# Altium schematic sheet interfaces_fpga.SchDoc
size A3
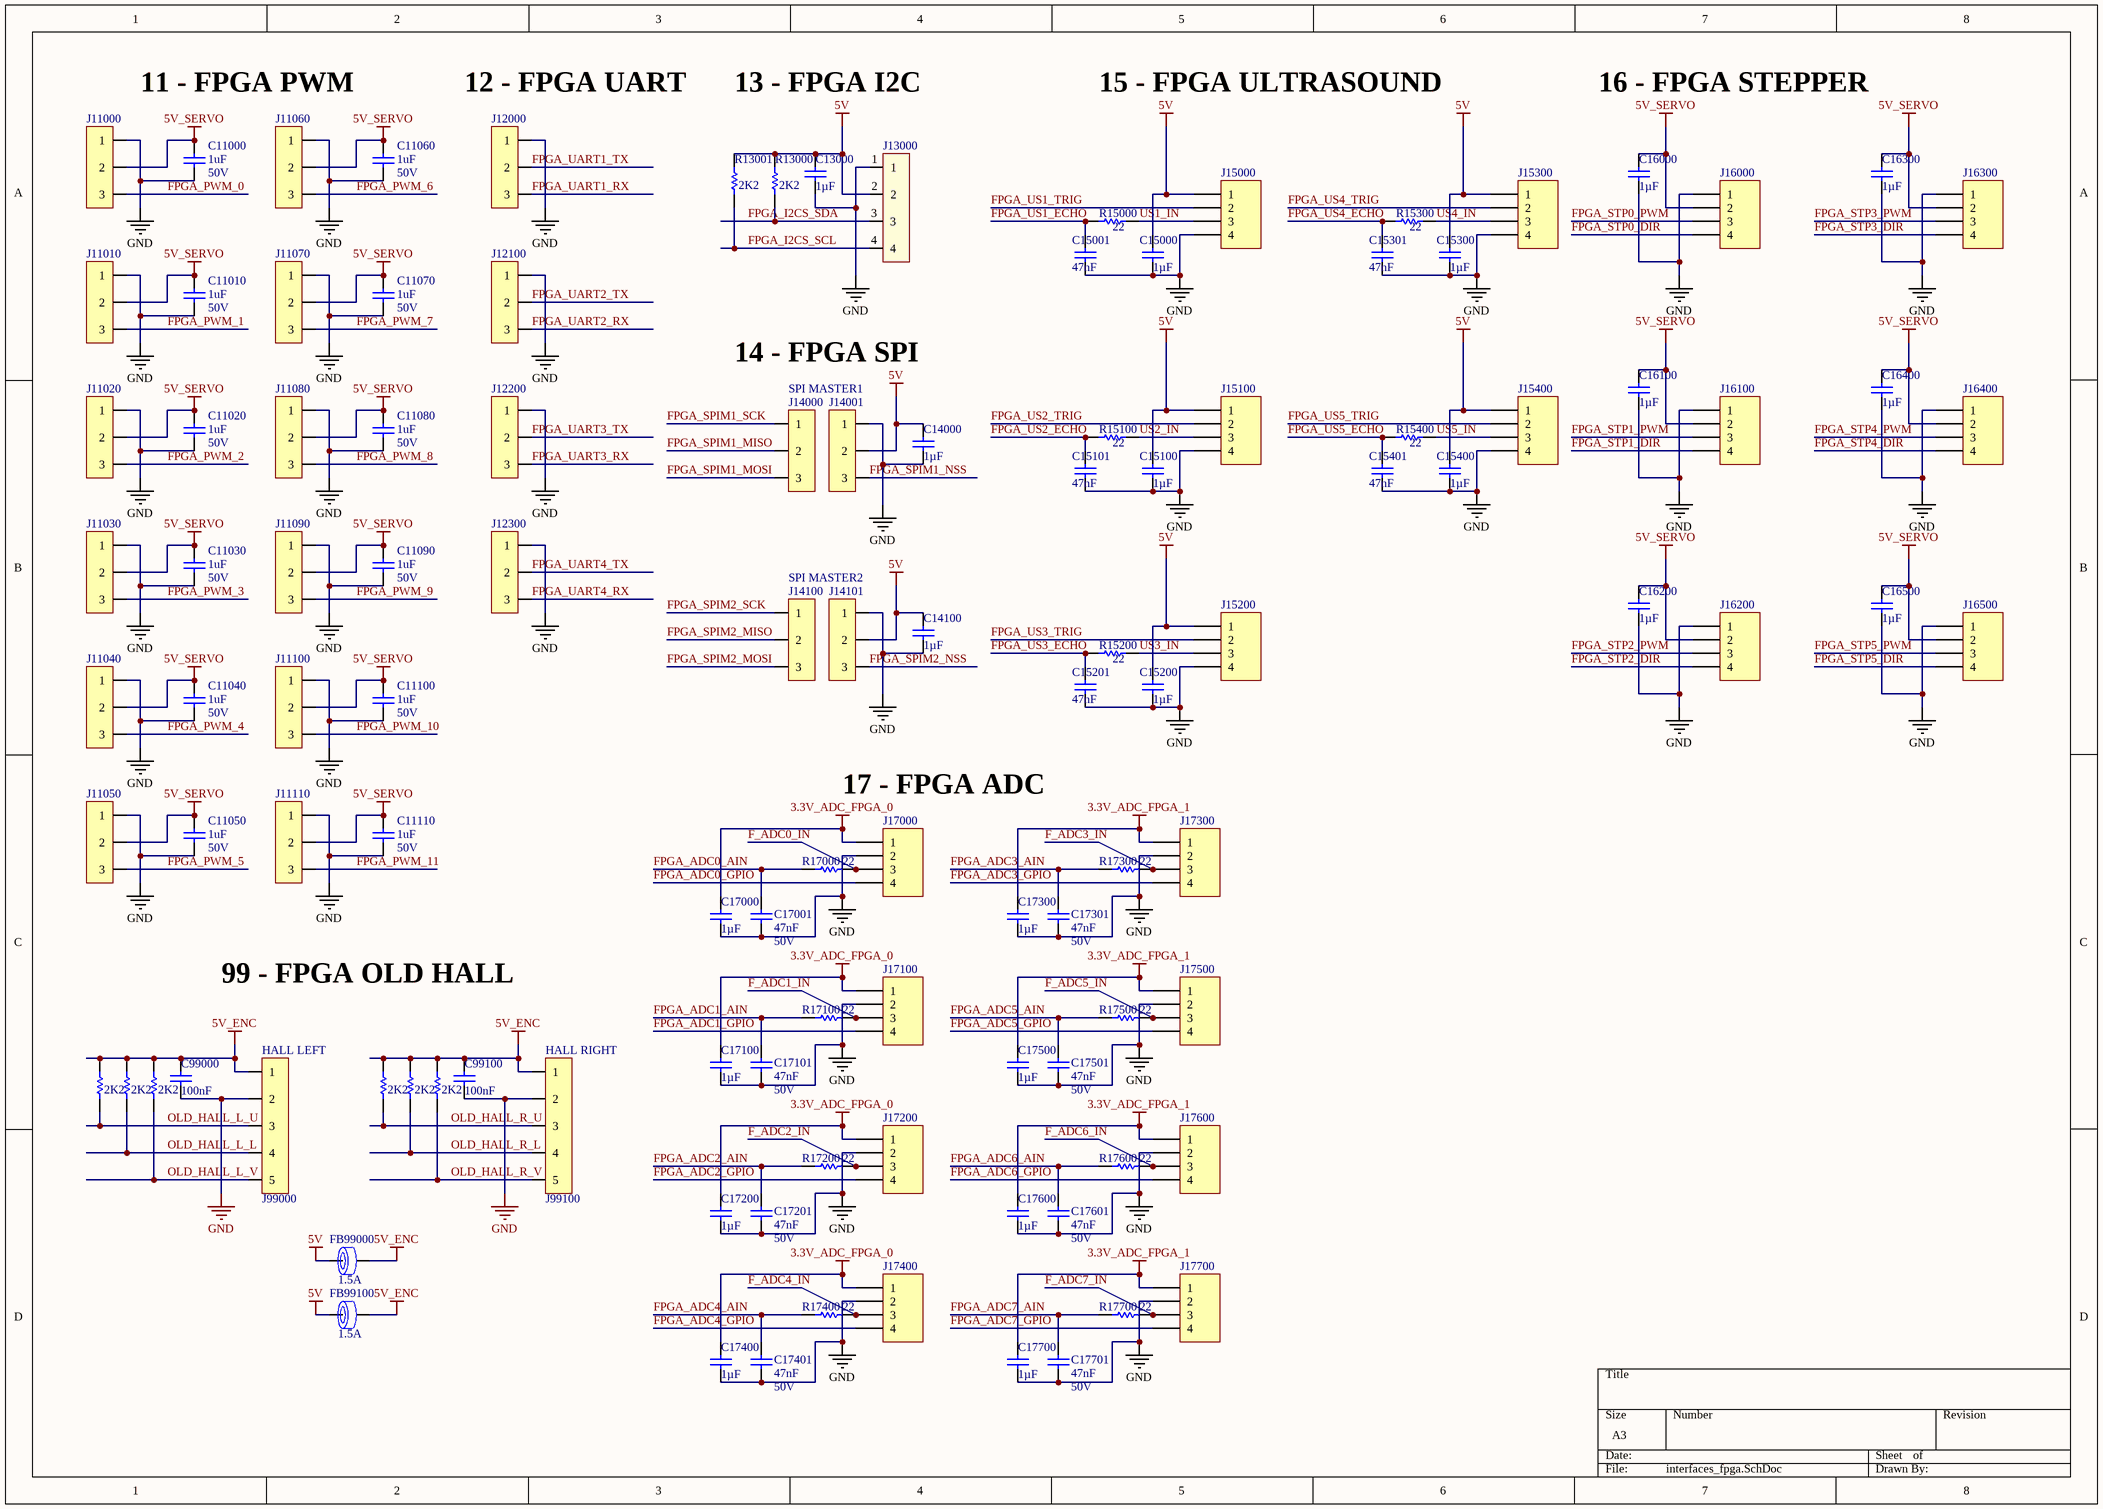
[diagram p0: interfaces_fpga.SchDoc]

## Parts
C11000  1uF  RatedVoltage: 50V  [WCAP-CSGP_0805, 2x1.25x1.25]
C11010  1uF  RatedVoltage: 50V  [WCAP-CSGP_0805, 2x1.25x1.25]
C11020  1uF  RatedVoltage: 50V  [WCAP-CSGP_0805, 2x1.25x1.25]
C11030  1uF  RatedVoltage: 50V  [WCAP-CSGP_0805, 2x1.25x1.25]
C11040  1uF  RatedVoltage: 50V  [WCAP-CSGP_0805, 2x1.25x1.25]
C11050  1uF  RatedVoltage: 50V  [WCAP-CSGP_0805, 2x1.25x1.25]
C11060  1uF  RatedVoltage: 50V  [WCAP-CSGP_0805, 2x1.25x1.25]
C11070  1uF  RatedVoltage: 50V  [WCAP-CSGP_0805, 2x1.25x1.25]
C11080  1uF  RatedVoltage: 50V  [WCAP-CSGP_0805, 2x1.25x1.25]
C11090  1uF  RatedVoltage: 50V  [WCAP-CSGP_0805, 2x1.25x1.25]
C11100  1uF  RatedVoltage: 50V  [WCAP-CSGP_0805, 2x1.25x1.25]
C11110  1uF  RatedVoltage: 50V  [WCAP-CSGP_0805, 2x1.25x1.25]
C13000  1µF  [WCAP-CSGP_0603, 1.6x0.8x0.8]
C14000  1µF  [WCAP-CSGP_0603, 1.6x0.8x0.8]
C14100  1µF  [WCAP-CSGP_0603, 1.6x0.8x0.8]
C15000  1µF  [WCAP-CSGP_0603, 1.6x0.8x0.8]
C15001  47nF  [WCAP-CSGP_0603, 1.6x0.8x0.8]
C15100  1µF  [WCAP-CSGP_0603, 1.6x0.8x0.8]
C15101  47nF  [WCAP-CSGP_0603, 1.6x0.8x0.8]
C15200  1µF  [WCAP-CSGP_0603, 1.6x0.8x0.8]
C15201  47nF  [WCAP-CSGP_0603, 1.6x0.8x0.8]
C15300  1µF  [WCAP-CSGP_0603, 1.6x0.8x0.8]
C15301  47nF  [WCAP-CSGP_0603, 1.6x0.8x0.8]
C15400  1µF  [WCAP-CSGP_0603, 1.6x0.8x0.8]
C15401  47nF  [WCAP-CSGP_0603, 1.6x0.8x0.8]
C16000  1µF  [WCAP-CSGP_0603, 1.6x0.8x0.8]
C16100  1µF  [WCAP-CSGP_0603, 1.6x0.8x0.8]
C16200  1µF  [WCAP-CSGP_0603, 1.6x0.8x0.8]
C16300  1µF  [WCAP-CSGP_0603, 1.6x0.8x0.8]
C16400  1µF  [WCAP-CSGP_0603, 1.6x0.8x0.8]
C16500  1µF  [WCAP-CSGP_0603, 1.6x0.8x0.8]
C17000  1µF  [WCAP-CSGP_0603, 1.6x0.8x0.8]
C17001  47nF  RatedVoltage: 50V  [WCAP-CSGP_0603, 1.6x0.8x0.8]
C17100  1µF  [WCAP-CSGP_0603, 1.6x0.8x0.8]
C17101  47nF  RatedVoltage: 50V  [WCAP-CSGP_0603, 1.6x0.8x0.8]
C17200  1µF  [WCAP-CSGP_0603, 1.6x0.8x0.8]
C17201  47nF  RatedVoltage: 50V  [WCAP-CSGP_0603, 1.6x0.8x0.8]
C17300  1µF  [WCAP-CSGP_0603, 1.6x0.8x0.8]
C17301  47nF  RatedVoltage: 50V  [WCAP-CSGP_0603, 1.6x0.8x0.8]
C17400  1µF  [WCAP-CSGP_0603, 1.6x0.8x0.8]
C17401  47nF  RatedVoltage: 50V  [WCAP-CSGP_0603, 1.6x0.8x0.8]
C17500  1µF  [WCAP-CSGP_0603, 1.6x0.8x0.8]
C17501  47nF  RatedVoltage: 50V  [WCAP-CSGP_0603, 1.6x0.8x0.8]
C17600  1µF  [WCAP-CSGP_0603, 1.6x0.8x0.8]
C17601  47nF  RatedVoltage: 50V  [WCAP-CSGP_0603, 1.6x0.8x0.8]
C17700  1µF  [WCAP-CSGP_0603, 1.6x0.8x0.8]
C17701  47nF  RatedVoltage: 50V  [WCAP-CSGP_0603, 1.6x0.8x0.8]
C99000  100nF  [WCAP-CSGP_0603, 1.6x0.8x0.8]
C99100  100nF  [WCAP-CSGP_0603, 1.6x0.8x0.8]
FB99000  RatedCurrent: 1.5A  [WE-CBF_0603_High Current]  (hidden comment: 742792624)
FB99100  RatedCurrent: 1.5A  [WE-CBF_0603_High Current]  (hidden comment: 742792624)
J11000  22-03-2031  [22-03-2031]  (value not drawn)
J11010  22-03-2031  [22-03-2031]  (value not drawn)
J11020  22-03-2031  [22-03-2031]  (value not drawn)
J11030  22-03-2031  [22-03-2031]  (value not drawn)
J11040  22-03-2031  [22-03-2031]  (value not drawn)
J11050  22-03-2031  [22-03-2031]  (value not drawn)
J11060  22-03-2031  [22-03-2031]  (value not drawn)
J11070  22-03-2031  [22-03-2031]  (value not drawn)
J11080  22-03-2031  [22-03-2031]  (value not drawn)
J11090  22-03-2031  [22-03-2031]  (value not drawn)
J11100  22-03-2031  [22-03-2031]  (value not drawn)
J11110  22-03-2031  [22-03-2031]  (value not drawn)
J12000  22-03-2031  [22-03-2031]  (value not drawn)
J12100  22-03-2031  [22-03-2031]  (value not drawn)
J12200  22-03-2031  [22-03-2031]  (value not drawn)
J12300  22-03-2031  [22-03-2031]  (value not drawn)
J13000  22-27-2041  [22-27-2041]  (value not drawn)
J14000  22-03-2031  [22-03-2031]  (value not drawn)
J14001  22-03-2031  [22-03-2031]  (value not drawn)
J14100  22-03-2031  [22-03-2031]  (value not drawn)
J14101  22-03-2031  [22-03-2031]  (value not drawn)
J15000  MC34645  [HDR1X4]  (value not drawn)
J15100  MC34645  [HDR1X4]  (value not drawn)
J15200  MC34645  [HDR1X4]  (value not drawn)
J15300  MC34645  [HDR1X4]  (value not drawn)
J15400  MC34645  [HDR1X4]  (value not drawn)
J16000  MC34645  [HDR1X4]  (value not drawn)
J16100  MC34645  [HDR1X4]  (value not drawn)
J16200  MC34645  [HDR1X4]  (value not drawn)
J16300  MC34645  [HDR1X4]  (value not drawn)
J16400  MC34645  [HDR1X4]  (value not drawn)
J16500  MC34645  [HDR1X4]  (value not drawn)
J17000  MC34645  [HDR1X4]  (value not drawn)
J17100  MC34645  [HDR1X4]  (value not drawn)
J17200  MC34645  [HDR1X4]  (value not drawn)
J17300  MC34645  [HDR1X4]  (value not drawn)
J17400  MC34645  [HDR1X4]  (value not drawn)
J17500  MC34645  [HDR1X4]  (value not drawn)
J17600  MC34645  [HDR1X4]  (value not drawn)
J17700  MC34645  [HDR1X4]  (value not drawn)
J99000  22-03-2051  [22-03-2051]  (value not drawn)
J99100  22-03-2051  [22-03-2051]  (value not drawn)
R13000  value 2K2  [RESC1005X04N]  (hidden comment: RC0402FR-07100RL)
R13001  value 2K2  [RESC1005X04N]  (hidden comment: RC0402FR-07100RL)
R15000  value 22  [RESC1005X04N]  (hidden comment: RC0402FR-0722RL)
R15100  value 22  [RESC1005X04N]  (hidden comment: RC0402FR-0722RL)
R15200  value 22  [RESC1005X04N]  (hidden comment: RC0402FR-0722RL)
R15300  value 22  [RESC1005X04N]  (hidden comment: RC0402FR-0722RL)
R15400  value 22  [RESC1005X04N]  (hidden comment: RC0402FR-0722RL)
R17000  value 22  [RESC1005X04N]  (hidden comment: RC0402FR-0722RL)
R17100  value 22  [RESC1005X04N]  (hidden comment: RC0402FR-0722RL)
R17200  value 22  [RESC1005X04N]  (hidden comment: RC0402FR-0722RL)
R17300  value 22  [RESC1005X04N]  (hidden comment: RC0402FR-0722RL)
R17400  value 22  [RESC1005X04N]  (hidden comment: RC0402FR-0722RL)
R17500  value 22  [RESC1005X04N]  (hidden comment: RC0402FR-0722RL)
R17600  value 22  [RESC1005X04N]  (hidden comment: RC0402FR-0722RL)
R17700  value 22  [RESC1005X04N]  (hidden comment: RC0402FR-0722RL)
R99000  value 2K2  [RESC1005X04N]  (hidden comment: RC0402FR-07100RL)
R99001  value 2K2  [RESC1005X04N]  (hidden comment: RC0402FR-07100RL)
R99002  value 2K2  [RESC1005X04N]  (hidden comment: RC0402FR-07100RL)
R99100  value 2K2  [RESC1005X04N]  (hidden comment: RC0402FR-07100RL)
R99101  value 2K2  [RESC1005X04N]  (hidden comment: RC0402FR-07100RL)
R99102  value 2K2  [RESC1005X04N]  (hidden comment: RC0402FR-07100RL)

## Nets
3.3V_ADC_FPGA_0: C17000.1 C17100.1 C17200.1 C17400.1 J17000.1 J17100.1 J17200.1 J17400.1
3.3V_ADC_FPGA_1: C17300.1 C17500.1 C17600.1 C17700.1 J17300.1 J17500.1 J17600.1 J17700.1
5V: C13000.1 C14000.1 C14100.1 C15000.1 C15100.1 C15200.1 C15300.1 C15400.1 FB99000.1 FB99100.1 J13000.2 J14001.2 J14101.2 J15000.1 J15100.1 J15200.1 J15300.1 J15400.1 R13000.2 R13001.2
5V_ENC: C99000.1 C99100.1 FB99000.2 FB99100.2 J99000.1 J99100.1 R99000.2 R99001.2 R99002.2 R99100.2 R99101.2 R99102.2
5V_SERVO: C11000.2 C11010.2 C11020.2 C11030.2 C11040.2 C11050.2 C11060.2 C11070.2 C11080.2 C11090.2 C11100.2 C11110.2 C16000.1 C16100.1 C16200.1 C16300.1 C16400.1 C16500.1 J11000.2 J11010.2 J11020.2 J11030.2 J11040.2 J11050.2 J11060.2 J11070.2 J11080.2 J11090.2 J11100.2 J11110.2 J16000.2 J16100.2 J16200.2 J16300.2 J16400.2 J16500.2
GND: C11000.1 C11010.1 C11020.1 C11030.1 C11040.1 C11050.1 C11060.1 C11070.1 C11080.1 C11090.1 C11100.1 C11110.1 C13000.2 C14000.2 C14100.2 C15000.2 C15001.1 C15100.2 C15101.1 C15200.2 C15201.1 C15300.2 C15301.1 C15400.2 C15401.1 C16000.2 C16100.2 C16200.2 C16300.2 C16400.2 C16500.2 C17000.2 C17001.1 C17100.2 C17101.1 C17200.2 C17201.1 C17300.2 C17301.1 C17400.2 C17401.1 C17500.2 C17501.1 C17600.2 C17601.1 C17700.2 C17701.1 C99000.2 C99100.2 J11000.1 J11010.1 J11020.1 J11030.1 J11040.1 J11050.1 J11060.1 J11070.1 J11080.1 J11090.1 J11100.1 J11110.1 J12000.1 J12100.1 J12200.1 J12300.1 J13000.1 J14001.1 J14101.1 J15000.4 J15100.4 J15200.4 J15300.4 J15400.4 J16000.1 J16100.1 J16200.1 J16300.1 J16400.1 J16500.1 J17000.2 J17100.2 J17200.2 J17300.2 J17400.2 J17500.2 J17600.2 J17700.2 J99000.2 J99100.2
F_ADC0_IN: J17000.3 R17000.2
F_ADC1_IN: J17100.3 R17100.2
F_ADC2_IN: J17200.3 R17200.2
F_ADC3_IN: J17300.3 R17300.2
F_ADC4_IN: J17400.3 R17400.2
F_ADC5_IN: J17500.3 R17500.2
F_ADC6_IN: J17600.3 R17600.2
F_ADC7_IN: J17700.3 R17700.2
FPGA_ADC0_AIN: C17001.2 R17000.1
FPGA_ADC0_GPIO: J17000.4
FPGA_ADC1_AIN: C17101.2 R17100.1
FPGA_ADC1_GPIO: J17100.4
FPGA_ADC2_AIN: C17201.2 R17200.1
FPGA_ADC2_GPIO: J17200.4
FPGA_ADC3_AIN: C17301.2 R17300.1
FPGA_ADC3_GPIO: J17300.4
FPGA_ADC4_AIN: C17401.2 R17400.1
FPGA_ADC4_GPIO: J17400.4
FPGA_ADC5_AIN: C17501.2 R17500.1
FPGA_ADC5_GPIO: J17500.4
FPGA_ADC6_AIN: C17601.2 R17600.1
FPGA_ADC6_GPIO: J17600.4
FPGA_ADC7_AIN: C17701.2 R17700.1
FPGA_ADC7_GPIO: J17700.4
FPGA_I2CS_SCL: J13000.4 R13001.1
FPGA_I2CS_SDA: J13000.3 R13000.1
FPGA_PWM_0: J11000.3
FPGA_PWM_1: J11010.3
FPGA_PWM_2: J11020.3
FPGA_PWM_3: J11030.3
FPGA_PWM_4: J11040.3
FPGA_PWM_5: J11050.3
FPGA_PWM_6: J11060.3
FPGA_PWM_7: J11070.3
FPGA_PWM_8: J11080.3
FPGA_PWM_9: J11090.3
FPGA_PWM_10: J11100.3
FPGA_PWM_11: J11110.3
FPGA_SPIM1_MISO: J14000.2
FPGA_SPIM1_MOSI: J14000.3
FPGA_SPIM1_NSS: J14001.3
FPGA_SPIM1_SCK: J14000.1
FPGA_SPIM2_MISO: J14100.2
FPGA_SPIM2_MOSI: J14100.3
FPGA_SPIM2_NSS: J14101.3
FPGA_SPIM2_SCK: J14100.1
FPGA_STP0_DIR: J16000.4
FPGA_STP0_PWM: J16000.3
FPGA_STP1_DIR: J16100.4
FPGA_STP1_PWM: J16100.3
FPGA_STP2_DIR: J16200.4
FPGA_STP2_PWM: J16200.3
FPGA_STP3_DIR: J16300.4
FPGA_STP3_PWM: J16300.3
FPGA_STP4_DIR: J16400.4
FPGA_STP4_PWM: J16400.3
FPGA_STP5_DIR: J16500.4
FPGA_STP5_PWM: J16500.3
FPGA_UART1_RX: J12000.3
FPGA_UART1_TX: J12000.2
FPGA_UART2_RX: J12100.3
FPGA_UART2_TX: J12100.2
FPGA_UART3_RX: J12200.3
FPGA_UART3_TX: J12200.2
FPGA_UART4_RX: J12300.3
FPGA_UART4_TX: J12300.2
FPGA_US1_ECHO: C15001.2 R15000.1
FPGA_US1_TRIG: J15000.2
FPGA_US2_ECHO: C15101.2 R15100.1
FPGA_US2_TRIG: J15100.2
FPGA_US3_ECHO: C15201.2 R15200.1
FPGA_US3_TRIG: J15200.2
FPGA_US4_ECHO: C15301.2 R15300.1
FPGA_US4_TRIG: J15300.2
FPGA_US5_ECHO: C15401.2 R15400.1
FPGA_US5_TRIG: J15400.2
OLD_HALL_L_L: J99000.4 R99001.1
OLD_HALL_L_U: J99000.3 R99000.1
OLD_HALL_L_V: J99000.5 R99002.1
OLD_HALL_R_L: J99100.4 R99101.1
OLD_HALL_R_U: J99100.3 R99100.1
OLD_HALL_R_V: J99100.5 R99102.1
US1_IN: J15000.3 R15000.2
US2_IN: J15100.3 R15100.2
US3_IN: J15200.3 R15200.2
US4_IN: J15300.3 R15300.2
US5_IN: J15400.3 R15400.2

## Notes on the sheet
- 11 - FPGA PWM
- (near J12000) 12 - FPGA UART
- 13 - FPGA I2C
- 15 - FPGA ULTRASOUND
- 16 - FPGA STEPPER
- 14 - FPGA SPI
- SPI MASTER1
- SPI MASTER2
- (near J17000) 17 - FPGA ADC
- 99 - FPGA OLD HALL
- (near J99000) HALL LEFT
- (near J99100) HALL RIGHT

## Library data of the parts
C11000 C11010 C11020 C11030 C11040 C11050 C11060 C11070 C11080 C11090 C11100 C11110 = WCAP-CSGP, 885012207103: CAP CER 1uF 50V X7R 0805; Manufacturer: Wurth Elektronik; PublishedDate: Aug 2016; ComponentLink1Description: Manufacturer; ComponentLink1URL: http://www.we-online.de; ComponentLink2Description: Datasheet; ComponentLink2URL: http://katalog.we-online.com/pbs/datasheet/885012207103.pdf; Manufacturer Part Number: 885012207103; Value: 1uF; Size: 0805; CeramicType: X7R; ComponentClass: 11_FPGA_PWM
C13000 C14000 C14100 C15000 C15100 C15200 C15300 C15400 C16000 C16100 C16200 C16300 C16400 C16500 C17000 C17100 C17200 C17300 C17400 C17500 C17600 C17700 C99000 C99100 = WCAP-CSGP, 885012206095: CAP CER 100nF 50V X7R 0603; Manufacturer: Wurth Elektronik; PublishedDate: Aug 2016; ComponentLink1Description: Manufacturer; ComponentLink1URL: http://www.we-online.de; ComponentLink2Description: Datasheet; ComponentLink2URL: http://katalog.we-online.com/pbs/datasheet/885012206095.pdf; Manufacturer Part Number: 885012206095; Value: 100nF; Size: 0603; CeramicType: X7R; RatedVoltage: 50V
  C13000: ComponentClass: 13_FPGA_I2C
  C14000 C14100: ComponentClass: 14_FPGA_SPI
  C15000 C15100 C15200 C15300 C15400: ComponentClass: 15_FPGA_US
  C16000 C16100 C16200 C16300 C16400 C16500: ComponentClass: 16_FPGA_STP
  C17000 C17100 C17200 C17300 C17400 C17500 C17600 C17700: ComponentClass: 17_FPGA_ADC
  C99000 C99100: ComponentClass: 99_FPGA_HALL
C15001 C15101 C15201 C15301 C15401 C17001 C17101 C17201 C17301 C17401 C17501 C17601 C17701 = WCAP-CSGP, 885012206093: CAP CER 47nF 50V X7R 0603; Manufacturer: Wurth Elektronik; PublishedDate: Aug 2016; ComponentLink1Description: Manufacturer; ComponentLink1URL: http://www.we-online.de; ComponentLink2Description: Datasheet; ComponentLink2URL: http://katalog.we-online.com/pbs/datasheet/885012206093.pdf; Manufacturer Part Number: 885012206093; Value: 47nF; Size: 0603; CeramicType: X7R
  C15001 C15101 C15201 C15301 C15401: RatedVoltage: 50V; ComponentClass: 15_FPGA_US
  C17001 C17101 C17201 C17301 C17401 C17501 C17601 C17701: ComponentClass: 17_FPGA_ADC
FB99000 FB99100 = WE-CBF, 742792624: Ferrite Bead 180ohm 0603 max1.5A; Manufacturer: Wurth Elektronik; Value: 180Ω; Type: High Current; PublishedDate: Aug 2016; ComponentLink1Description: Manufacturer; ComponentLink1URL: http://www.we-online.de; ComponentLink2Description: Datasheet; ComponentLink2URL: http://katalog.we-online.de/pbs/datasheet/742792624.pdf; Manufacturer Part Number: 742792624; Size: 0603; ComponentClass: 9_NUCLEO_ODO
J11000 J11010 J11020 J11030 J11040 J11050 J11060 J11070 J11080 J11090 J11100 J11110 J12000 J12100 J12200 J12300 J14000 J14001 J14100 J14101 = 22-03-2031: Manufacturer 1: MOLEX; Supplier 1: Farnell; Supplier Part Number 1: 9731083; Manufacturer Part Number: 22-03-2031; Pricing: 10=0.27, 100=0.242, 200=0.22, 500=0.208, 1000=0.202, 2500=0.196 (EUR); ComponentLink1URL: http://www.farnell.com/cad/1533907.pdf; ComponentLink1Description: http://www.farnell.com/cad/1533907.pdf; ComponentLink2URL: http://www.farnell.com/datasheets/1785732.pdf; ComponentLink2Description: http://www.farnell.com/datasheets/1785732.pdf
  J11000 J11010 J11020 J11030 J11040 J11050 J11060 J11070 J11080 J11090 J11100 J11110: ComponentClass: 11_FPGA_PWM
  J12000 J12100 J12200 J12300: ComponentClass: 12_FPGA_UART
  J14000 J14001 J14100 J14101: ComponentClass: 14_FPGA_SPI
J13000 = 22-27-2041: Manufacturer 1: MOLEX; Manufacturer Part Number: 22-27-2041..; Supplier 1: Farnell; Supplier Part Number 1: 9731164; Pricing: 10=0.28, 100=0.24, 200=0.22, 500=0.199, 1000=0.175, 2500=0.128, 2500=0.0898, 30000=0.0812 (EUR); ComponentLink1URL: http://www.farnell.com/cad/1595526.pdf; ComponentLink1Description: http://www.farnell.com/cad/1595526.pdf; ComponentLink2URL: http://www.farnell.com/datasheets/1803079.pdf; ComponentLink2Description: http://www.farnell.com/datasheets/1803079.pdf; ComponentClass: 15_FPGA_US
J15000 J15100 J15200 J15300 J15400 J16000 J16100 J16200 J16300 J16400 J16500 J17000 J17100 J17200 J17300 J17400 J17500 J17600 J17700 = MC34645: MULTICOMP - MC34645 - EMB. MALE COUDEE  CON. MALE 2.54MM 4VOIE; Supplier 1: Farnell; Manufacturer: MULTICOMP; Manufacturer Part Number: MC34645; ComponentLink1URL: http://www.farnell.com/datasheets/1751312.pdf; ComponentLink1Description: http://www.farnell.com/datasheets/1751312.pdf; Pricing: 1=0.597, 5=0.531, 25=0.465, 50=0.399, 100=0.334, 250=0.138 (EUR); Supplier Part Number 1: 1675775
  J15000 J15100 J15200 J15300 J15400: ComponentClass: 15_FPGA_US
  J16000 J16100 J16200 J16300 J16400 J16500: ComponentClass: 16_FPGA_STP
  J17000 J17100 J17200 J17300 J17400 J17500 J17600 J17700: ComponentClass: 17_FPGA_ADC
J99000 J99100 = 22-03-2051: Manufacturer 1: MOLEX; Supplier 1: Farnell; Supplier Part Number 1: 9731105; Manufacturer Part Number: 22-03-2051; Pricing: 10=0.43, 100=0.35, 200=0.29, 500=0.26, 1000=0.24, 2500=0.191, 2500=0.172, 20000=0.155 (EUR); ComponentLink1URL: http://www.farnell.com/cad/1533907.pdf; ComponentLink1Description: http://www.farnell.com/cad/1533907.pdf; ComponentLink2URL: http://www.farnell.com/datasheets/1803075.pdf; ComponentLink2Description: http://www.farnell.com/datasheets/1803075.pdf; ComponentClass: 99_FPGA_HALL
R13000 R13001 R99000-R99002 R99100-R99102 = RC0402FR-07100RL: RES SMD 100 OHM 1% 1/16W 0402; Manufacturer: Yageo; Power: 63mW; Vmax: 50V; Type: Thick Film; ComponentLink1Description: Manufacturer; ComponentLink1URL: http://www.yageo.com/NewPortal/_en/index.jsp; ComponentLink2Description: Datasheet; ComponentLink2URL: http://www.farnell.com/datasheets/2167052.pdf; Manufacturer Part Number: RC0402FR-07100RL; Supplier 1: Farnell; Supplier Part Number 1: 9239111; Precision: ±1%
  R13000 R13001: ComponentClass: 13_FPGA_I2C
  R99000-R99002 R99100-R99102: ComponentClass: 99_FPGA_HALL
R15000 R15100 R15200 R15300 R15400 R17000 R17100 R17200 R17300 R17400 R17500 R17600 R17700 = RC0402FR-0722RL: RES SMD 22 OHM 1% 1/16W 0402; Manufacturer: Yageo; Power: 63mW; Vmax: 50V; Type: Thick Film; ComponentLink1Description: Manufacturer; ComponentLink1URL: http://www.yageo.com/NewPortal/_en/index.jsp; ComponentLink2Description: Datasheet; ComponentLink2URL: http://www.farnell.com/datasheets/2167052.pdf; Manufacturer Part Number: RC0402FR-0722RL; Supplier 1: Farnell; Supplier Part Number 1: 9239030; Precision: ±1%
  R15000 R15100 R15200 R15300 R15400: ComponentClass: 15_FPGA_US
  R17000 R17100 R17200 R17300 R17400 R17500 R17600 R17700: ComponentClass: 17_FPGA_ADC